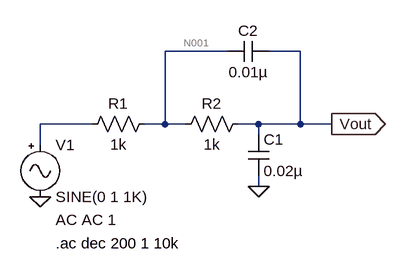
[diagram p0: schematic Sallen-Key lowpass.asc]
Sallen-Key lowpass.asc, the LTspice schematic file:
Version 4
SHEET 1 880 680
WIRE 320 80 224 80
WIRE 432 80 384 80
WIRE 112 192 32 192
WIRE 224 192 224 80
WIRE 224 192 192 192
WIRE 256 192 224 192
WIRE 368 192 336 192
WIRE 432 192 432 80
WIRE 432 192 368 192
WIRE 480 192 432 192
WIRE 368 208 368 192
WIRE 32 224 32 192
WIRE 368 288 368 272
FLAG 480 192 Vout
IOPIN 480 192 Out
FLAG 32 304 0
FLAG 368 288 0
SYMBOL res 208 176 R90
WINDOW 0 0 56 VBottom 2
WINDOW 3 32 56 VTop 2
SYMATTR InstName R1
SYMATTR Value 1k
SYMBOL res 352 176 R90
WINDOW 0 0 56 VBottom 2
WINDOW 3 32 56 VTop 2
SYMATTR InstName R2
SYMATTR Value 1k
SYMBOL cap 352 208 R0
SYMATTR InstName C1
SYMATTR Value 0.02µ
SYMBOL cap 384 64 R90
WINDOW 0 0 32 VBottom 2
WINDOW 3 32 32 VTop 2
SYMATTR InstName C2
SYMATTR Value 0.01µ
SYMBOL Misc\\signal 32 208 R0
WINDOW 123 24 132 Left 2
WINDOW 39 0 0 Left 0
SYMATTR Value2 AC AC 1
SYMATTR InstName V1
TEXT 56 376 Left 2 !.ac dec 200 1 10k

The netlist it stands for:
* Sallen-Key lowpass.asc
R1 N001 N002 1k
R2 Vout N001 1k
C1 Vout 0 0.02µ
C2 Vout N001 0.01µ
V1 N002 0 SINE(0 1 1K) AC AC 1
.ac dec 200 1 10k
.backanno
.end

* Results of the author's LTspice run, read from the files saved beside the schematic
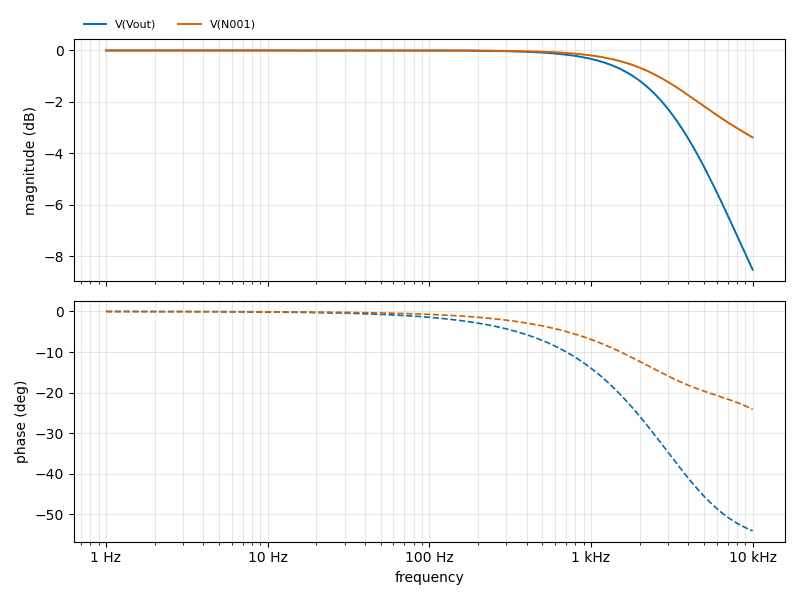
[diagram p1: AC Analysis of Sallen-Key lowpass.asc, plotted from the saved traces]
* AC Analysis, 1 run:
*   V(Vout): -0.00 dB at 1 Hz, -8.52 dB at 10 kHz, peak -0.00 dB at 1 Hz, 3 dB below the peak at 3.631 kHz
*   V(N001): -0.00 dB at 1 Hz, -3.38 dB at 10 kHz, peak -0.00 dB at 1 Hz, 3 dB below the peak at 7.958 kHz